# Altium schematic sheet Carte_Alim_2019_MOT.SchDoc
size A4; Author: Audran; CompanyName: Goldorak; Address1: Electrolab; Address2: 52 rue Paul Lescop; Address3: 92000 Nanterre; DocumentNumber: 3; SheetNumber: 3; SheetTotal: 5; ProjectName: Cartes_2017
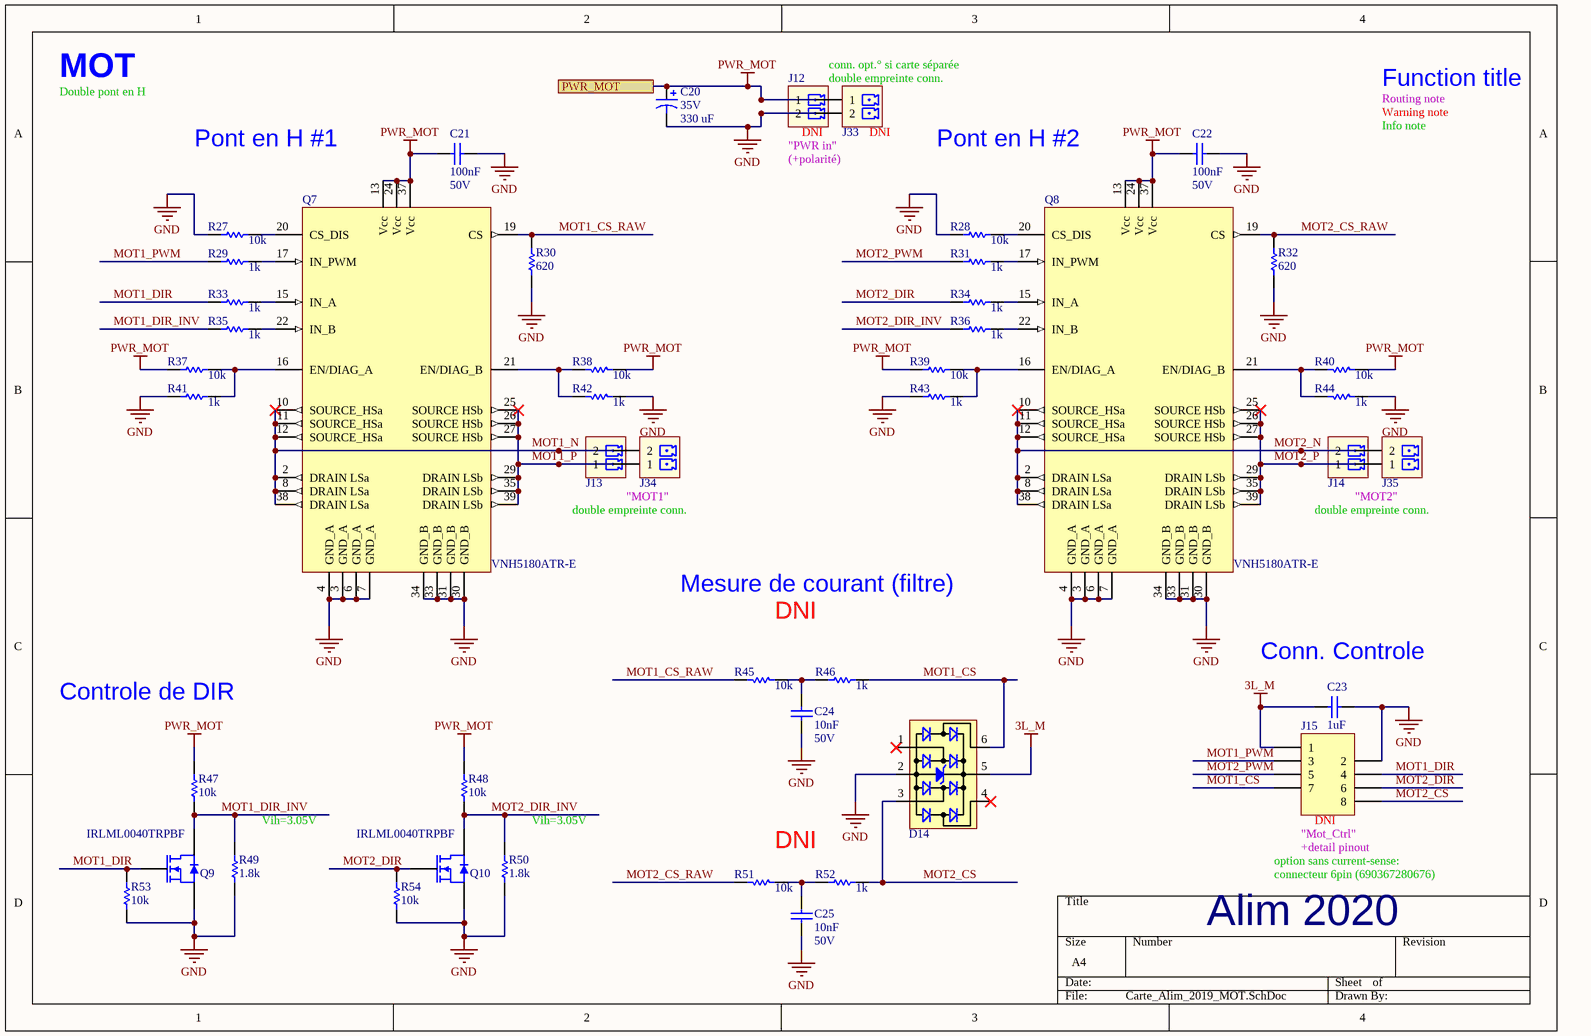
[diagram p0: Carte_Alim_2019_MOT.SchDoc]

## Parts
C20  330 uF  RatedVoltage: 35V  [WCAP-ATG8_10x12.5x5x0.6]
C21  100nF  RatedVoltage: 50V  [WCAP-CSGP_0603, 1.6x0.8x0.8]
C22  100nF  RatedVoltage: 50V  [WCAP-CSGP_0603, 1.6x0.8x0.8]
C23  1uF  [WCAP-CSGP_0805, 2x1.25x1.25]
C24  10nF  RatedVoltage: 50V  [WCAP-CSGP_0402, 1x0.5x0.5]
C25  10nF  RatedVoltage: 50V  [WCAP-CSGP_0402, 1x0.5x0.5]
D14  82400274  [SC70-6L]  (value not drawn)
J12  691322110002  [691322110002]  (value not drawn)
J13  691322110002  [691322110002]  (value not drawn)
J14  691322110002  [691322110002]  (value not drawn)
J15  690367280876  [690367280876]  (value not drawn)
J33  691321100002  [691321100002]  (value not drawn)
J34  691321100002  [691321100002]  (value not drawn)
J35  691321100002  [691321100002]  (value not drawn)
Q7  VNH5180ATR-E  [SSOP50P1030X247-36N]
Q8  VNH5180ATR-E  [SSOP50P1030X247-36N]
Q9  IRLML0040TRPBF  [SOT-23]
Q10  IRLML0040TRPBF  [SOT-23]
R27  value 10k  [RESC1608X06N]  (hidden comment: RC0603FR-0710KL)
R28  value 10k  [RESC1608X06N]  (hidden comment: RC0603FR-0710KL)
R29  value 1k  [RESC1608X06N]  (hidden comment: RC0603FR-071KL)
R30  value 620  [RESC1005X04N]  (hidden comment: RC0402FR-07620RL)
R31  value 1k  [RESC1608X06N]  (hidden comment: RC0603FR-071KL)
R32  value 620  [RESC1005X04N]  (hidden comment: RC0402FR-07620RL)
R33  value 1k  [RESC1608X06N]  (hidden comment: RC0603FR-071KL)
R34  value 1k  [RESC1608X06N]  (hidden comment: RC0603FR-071KL)
R35  value 1k  [RESC1608X06N]  (hidden comment: RC0603FR-071KL)
R36  value 1k  [RESC1608X06N]  (hidden comment: RC0603FR-071KL)
R37  value 10k  [RESC1608X06N]  (hidden comment: RC0603FR-0710KL)
R38  value 10k  [RESC1608X06N]  (hidden comment: RC0603FR-0710KL)
R39  value 10k  [RESC1608X06N]  (hidden comment: RC0603FR-0710KL)
R40  value 10k  [RESC1608X06N]  (hidden comment: RC0603FR-0710KL)
R41  value 1k  [RESC1608X06N]  (hidden comment: RC0603FR-071KL)
R42  value 1k  [RESC1608X06N]  (hidden comment: RC0603FR-071KL)
R43  value 1k  [RESC1608X06N]  (hidden comment: RC0603FR-071KL)
R44  value 1k  [RESC1608X06N]  (hidden comment: RC0603FR-071KL)
R45  value 10k  [RESC1608X06N]  (hidden comment: RC0603FR-0710KL)
R46  value 1k  [RESC1608X06N]  (hidden comment: RC0603FR-071KL)
R47  value 10k  [RESC1608X06N]  (hidden comment: RC0603FR-0710KL)
R48  value 10k  [RESC1608X06N]  (hidden comment: RC0603FR-0710KL)
R49  value 1.8k  [RESC1608X06N]  (hidden comment: RC0603FR-071K8L)
R50  value 1.8k  [RESC1608X06N]  (hidden comment: RC0603FR-071K8L)
R51  value 10k  [RESC1608X06N]  (hidden comment: RC0603FR-0710KL)
R52  value 1k  [RESC1608X06N]  (hidden comment: RC0603FR-071KL)
R53  value 10k  [RESC1608X06N]  (hidden comment: RC0603FR-0710KL)
R54  value 10k  [RESC1608X06N]  (hidden comment: RC0603FR-0710KL)

## Ports
PWR_MOT

## Nets
3L_M: C23.2 D14.5 J15.1
GND: C20.2 C21.1 C22.1 C23.1 C24.1 C25.1 D14.2 J12.2 J15.2 J33.2 Q7.3(GND_A) Q7.4(GND_A) Q7.6(GND_A) Q7.7(GND_A) Q7.30(GND_B) Q7.31(GND_B) Q7.33(GND_B) Q7.34(GND_B) Q8.3(GND_A) Q8.4(GND_A) Q8.6(GND_A) Q8.7(GND_A) Q8.30(GND_B) Q8.31(GND_B) Q8.33(GND_B) Q8.34(GND_B) Q9.2(S) Q10.2(S) R27.1 R28.1 R30.1 R32.1 R41.1 R42.1 R43.1 R44.1 R49.1 R50.1 R53.1 R54.1
PWR_MOT: C20.1 C21.2 C22.2 J12.1 J33.1 Q7.13(Vcc) Q7.24(Vcc) Q7.37(Vcc) Q8.13(Vcc) Q8.24(Vcc) Q8.37(Vcc) R37.2 R38.2 R39.2 R40.2 R47.2 R48.2 ; port PWR_MOT
MOT1_CS: D14.6 J15.7 R46.2
MOT1_CS_RAW: Q7.19(CS) R30.2 R45.1
MOT1_DIR: J15.4 Q9.1(G) R33.1 R53.2
MOT1_DIR_INV: Q9.3(D) R35.1 R47.1 R49.2
MOT1_N: J13.2 J34.2 Q7.2(DRAIN_LSa) Q7.8(DRAIN_LSa) Q7.10(SOURCE_HSa) Q7.11(SOURCE_HSa) Q7.12(SOURCE_HSa) Q7.38(DRAIN_LSa)
MOT1_P: J13.1 J34.1 Q7.25(SOURCE_HSb) Q7.26(SOURCE_HSb) Q7.27(SOURCE_HSb) Q7.29(DRAIN_LSb) Q7.35(DRAIN_LSb) Q7.39(DRAIN_LSb)
MOT1_PWM: J15.3 R29.1
MOT2_CS: D14.3 J15.8 R52.2
MOT2_CS_RAW: Q8.19(CS) R32.2 R51.1
MOT2_DIR: J15.6 Q10.1(G) R34.1 R54.2
MOT2_DIR_INV: Q10.3(D) R36.1 R48.1 R50.2
MOT2_N: J14.2 J35.2 Q8.2(DRAIN_LSa) Q8.8(DRAIN_LSa) Q8.10(SOURCE_HSa) Q8.11(SOURCE_HSa) Q8.12(SOURCE_HSa) Q8.38(DRAIN_LSa)
MOT2_P: J14.1 J35.1 Q8.25(SOURCE_HSb) Q8.26(SOURCE_HSb) Q8.27(SOURCE_HSb) Q8.29(DRAIN_LSb) Q8.35(DRAIN_LSb) Q8.39(DRAIN_LSb)
MOT2_PWM: J15.5 R31.1
NetC24_2: C24.2 R45.2 R46.1
NetC25_2: C25.2 R51.2 R52.1
NetQ7_15: Q7.15(IN_A) R33.2
NetQ7_16: Q7.16(EN/DIAG_A) R37.1 R41.2
NetQ7_17: Q7.17(IN_PWM) R29.2
NetQ7_20: Q7.20(CS_DIS) R27.2
NetQ7_21: Q7.21(EN/DIAG_B) R38.1 R42.2
NetQ7_22: Q7.22(IN_B) R35.2
NetQ8_15: Q8.15(IN_A) R34.2
NetQ8_16: Q8.16(EN/DIAG_A) R39.1 R43.2
NetQ8_17: Q8.17(IN_PWM) R31.2
NetQ8_20: Q8.20(CS_DIS) R28.2
NetQ8_21: Q8.21(EN/DIAG_B) R40.1 R44.2
NetQ8_22: Q8.22(IN_B) R36.2

Not connected (* = marked no-connect by the designer): D14 1* 4*; Q7 1(nc) 5(nc) 9(nc) 14(nc) 18(nc) 23(nc) 28(nc) 32(nc) 36(nc); Q8 1(nc) 5(nc) 9(nc) 14(nc) 18(nc) 23(nc) 28(nc) 32(nc) 36(nc)

## Notes on the sheet
- MOT
- Double pont en H
- (near J33) conn. opt.° si carte séparée
- (near J33) double empreinte conn.
- Routing note
- Warning note
- Function title
- Pont en H #1
- "PWR in"
- (+polarité)
- DNI
- (near J33) DNI
- Pont en H #2
- Info note
- double empreinte conn.
- (near J34) "MOT1"
- "MOT2"
- (near Q8) Mesure de courant (filtre)
- Controle de DIR
- (near C23) Conn. Controle
- (near R49) Vih=3.05V
- (near R50) Vih=3.05V
- (near J15) "Mot_Ctrl"
- (near J15) +detail pinout
- (near J15) DNI
- option sans current-sense:
- connecteur 6pin (690367280676)
- Alim 2020

## Library data of the parts
C20 = WCAP-ATG8, 860010575012: CAP Alu 330 UF 20% 35 V; Manufacturer: Wurth Elektronik; PublishedDate: July 2016; ComponentLink1Description: Manufacturer; ComponentLink1URL: http://www.we-online.de; ComponentLink2Description: Datasheet; ComponentLink2URL: http://katalog.we-online.de/pbs/datasheet/860010575012.pdf; Manufacturer Part Number: 860010575012; Value: 330 uF; Size: 10mmx12.5mm
C21 C22 = WCAP-CSGP, 885012206095: CAP CER 100nF 50V X7R 0603; Manufacturer: Wurth Elektronik; PublishedDate: Aug 2016; ComponentLink1Description: Manufacturer; ComponentLink1URL: http://www.we-online.de; ComponentLink2Description: Datasheet; ComponentLink2URL: http://katalog.we-online.com/pbs/datasheet/885012206095.pdf; Value: 100nF; Size: 0603; CeramicType: X7R; Manufacturer Part Number: 885012206095
C23 = WCAP-CSGP, 885012207103: CAP CER 1uF 50V X7R 0805; Manufacturer: Wurth Elektronik; PublishedDate: Aug 2016; ComponentLink1Description: Manufacturer; ComponentLink1URL: http://www.we-online.de; ComponentLink2Description: Datasheet; ComponentLink2URL: http://katalog.we-online.com/pbs/datasheet/885012207103.pdf; Manufacturer Part Number: 885012207103; Value: 1uF; Size: 0805; CeramicType: X7R; RatedVoltage: 50V
C24 C25 = WCAP-CSGP, 885012205067: CAP CER 10nF 50V X7R 0402; Manufacturer: Wurth Elektronik; PublishedDate: Aug 2016; ComponentLink1Description: Manufacturer; ComponentLink1URL: http://www.we-online.de; ComponentLink2Description: Datasheet; ComponentLink2URL: http://katalog.we-online.com/pbs/datasheet/885012205067.pdf; Manufacturer Part Number: 885012205067; Value: 10nF; Size: 0402; CeramicType: X7R
D14 = 82400274: WE-TVS TVS Diode 4+1Ch 5V SC70-6L; Manufacturer: Wurth Elektronik; ComponentLink1Description: Datasheet; ComponentLink1URL: https://www.we-online.com/catalog/datasheet/82400274.pdf; Manufacturer Part Number: 82400274; Supplier 1: RSComponents; Supplier Part Number 1: 7546216; Type: TVS; Value: 5V; Supplier 2: JLCPCB; Supplier Part Number 2: C85364
J12-J14 = 691322110002: WR-TBL 2p Series 3221 - 3.50 mm Horizontal PCB Header; Manufacturer: Wurth Electronics Inc.; Value: 2; Supplier 1: Farnell; Manufacturer Part Number: 691322110002; ComponentLink1URL: http://katalog.we-online.de/em/datasheet/6913221100xx.pdf; ComponentLink1Description: Datasheet; Supplier Part Number 1: 1841315
J15 = 690367280876: WR-MM 8p Female SMT Connector with Polarization; Manufacturer: Wurth Electronics Inc.; Value: 8; Manufacturer Part Number: 690367280876; ComponentLink1Description: Datasheet; ComponentLink1URL: http://katalog.we-online.de/em/datasheet/69036728xx76.pdf; Supplier 1: Farnell; Supplier Part Number 1: 1641850
J33-J35 = 691321100002: WR-TBL 2p Series 3211 - 3.50 mm Vertical PCB Header; Manufacturer: Wurth Electronics Inc.; Value: 2; Supplier 1: Farnell; Manufacturer Part Number: 691321100002; Supplier Part Number 1: 1841308; ComponentLink1Description: Datasheet; ComponentLink1URL: https://katalog.we-online.de/em/datasheet/6913211000xx.pdf
Q7 Q8 = VNH5180ATR-E: IC MOTOR DRIVER PAR 36POWERSSO; Manufacturer: STMicroelectronics; Manufacturer Part Number: VNH5180ATR-E; ComponentLink1URL: http://www.st.com/content/ccc/resource/technical/document/datasheet/ce/72/6c/f3/65/47/45/b3/CD00264619.pdf/files/CD00264619.pdf/jcr:content/translations/en.CD00264619.pdf; ComponentLink1Description: Datasheet; Supplier 1: Digi-Key; Supplier Part Number 1: 497-13075-6-ND
Q9 Q10 = IRLML0040: MOSFET N 40V 3.6A SOT23; Manufacturer: INTERNATIONAL RECTIFIER; Supplier 1: Farnell; Supplier Part Number 1: 1831088; Manufacturer Part Number: IRLML0040TRPBF; ComponentLink1Description: http://www.irf.com/product-info/datasheets/data/irlml0040pbf.pdf; ComponentLink1URL: http://www.irf.com/product-info/datasheets/data/irlml0040pbf.pdf
R27 R28 R37-R40 R45 R47 R48 R51 R53 R54 = RC0603FR-0710KL: RES SMD 10K OHM 1% 1/10W 0603; Manufacturer: Yageo; Power: 100mW; Vmax: 50V; Type: Thick Film; ComponentLink1Description: Manufacturer; ComponentLink1URL: http://www.yageo.com/NewPortal/_en/index.jsp; ComponentLink2Description: Datasheet; ComponentLink2URL: http://www.farnell.com/datasheets/2167052.pdf; Supplier 1: Farnell; Supplier Part Number 1: 9238603; Manufacturer Part Number: RC0603FR-0710KL; Precision: ±1%
R29 R31 R33-R36 R41-R44 R46 R52 = RC0603FR-071KL: RES SMD 1K OHM 1% 1/10W 0603; Manufacturer: Yageo; Power: 100mW; Vmax: 50V; Type: Thick Film; ComponentLink1Description: Manufacturer; ComponentLink1URL: http://www.yageo.com/NewPortal/_en/index.jsp; ComponentLink2Description: Datasheet; ComponentLink2URL: http://www.farnell.com/datasheets/2167052.pdf; Manufacturer Part Number: RC0603FR-071KL; Supplier 1: Farnell; Supplier Part Number 1: 9238484; Precision: ±1%
R30 R32 = RC0402FR-07620RL: RES SMD 620 OHM 1% 1/16W 0402; Manufacturer: Yageo; Power: 63mW; Vmax: 50V; Type: Thick Film; ComponentLink1Description: Manufacturer; ComponentLink1URL: http://www.yageo.com/NewPortal/_en/index.jsp; ComponentLink2Description: Datasheet; ComponentLink2URL: http://www.farnell.com/datasheets/2167052.pdf; Manufacturer Part Number: RC0402FR-07620RL; Precision: ±1%; Supplier 1: Farnell; Supplier Part Number 1: 1458815
R49 R50 = RC0603FR-071K8L: RES SMD 1.8K OHM 1% 1/10W 0603; Manufacturer: Yageo; Power: 100mW; Vmax: 50V; Manufacturer Part Number: RC0603FR-071K8L; Type: Thick Film; ComponentLink1Description: Manufacturer; ComponentLink1URL: http://www.yageo.com/NewPortal/_en/index.jsp; ComponentLink2Description: Datasheet; ComponentLink2URL: http://www.farnell.com/datasheets/2167052.pdf; Precision: ±1%; Supplier 1: Farnell; Supplier Part Number 1: 9238514